# Altium schematic sheet design1.SchDoc
size 578 x 245 mm; Origin: Eagle
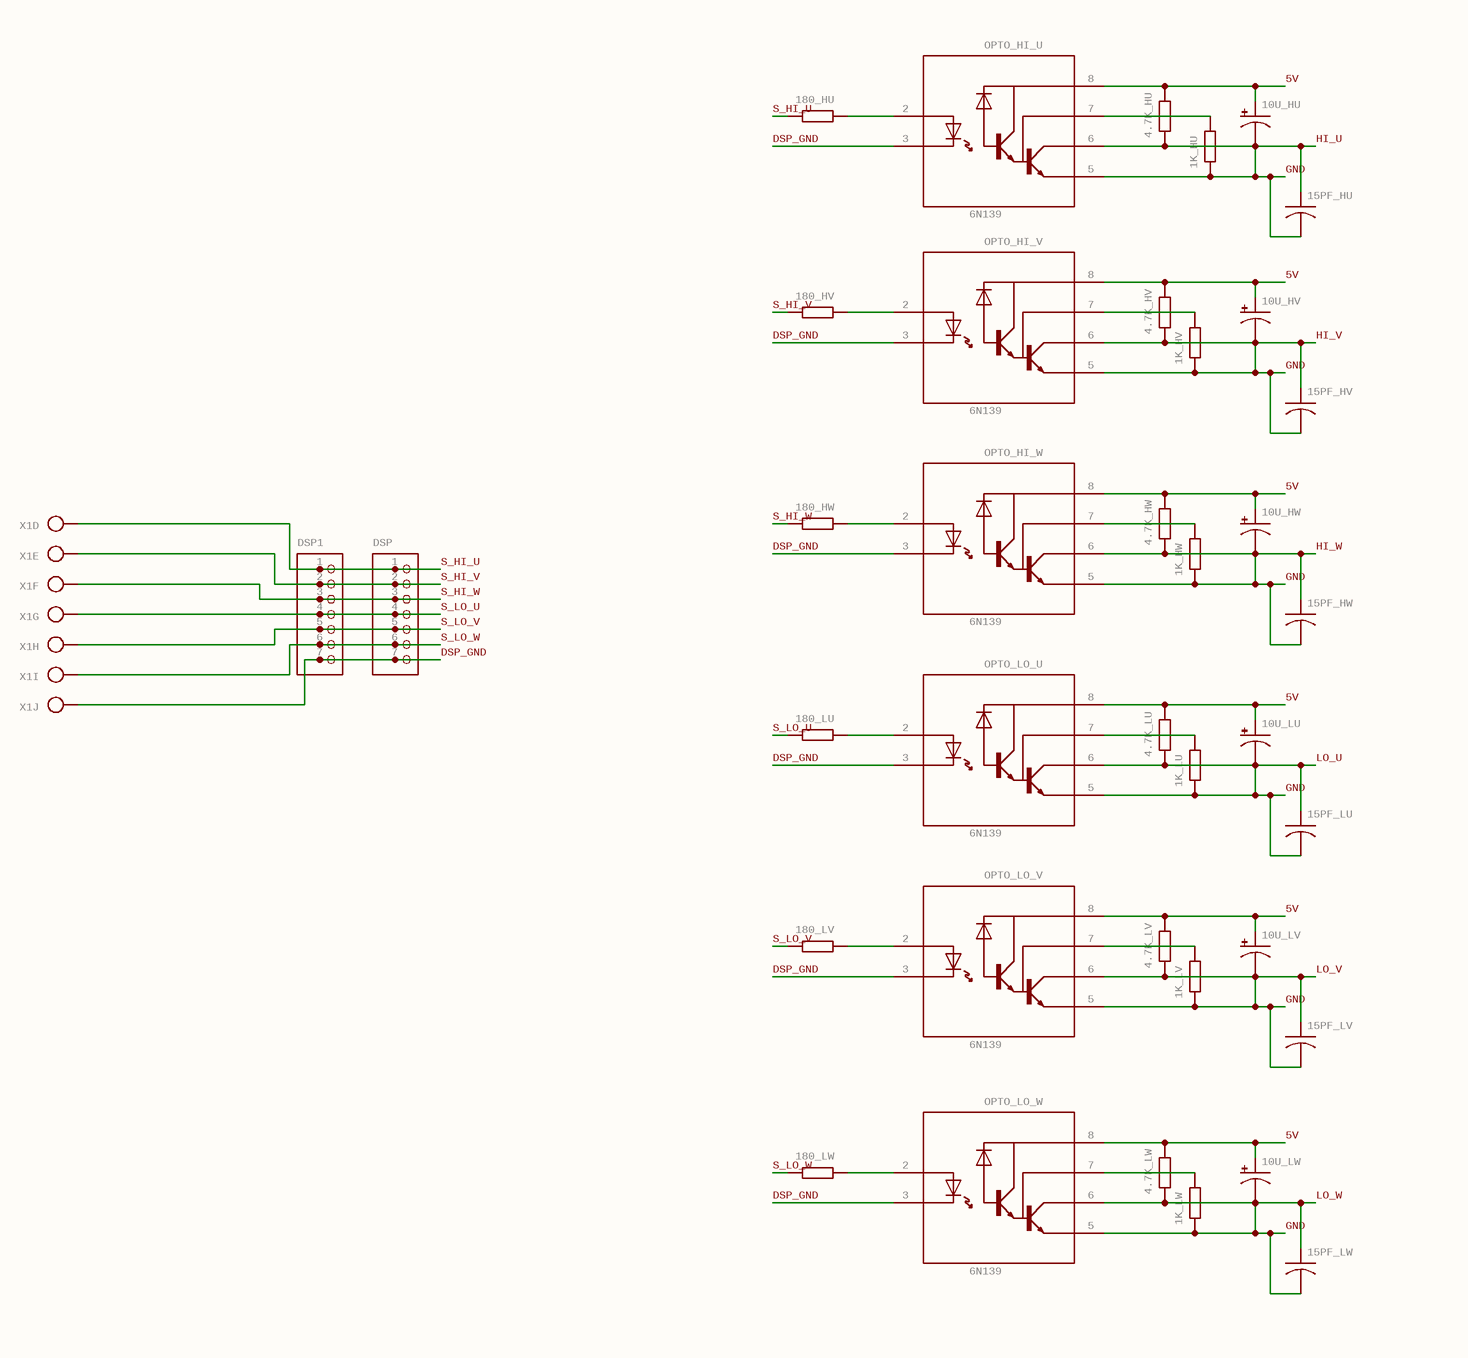
[diagram p0: design1.SchDoc, left]
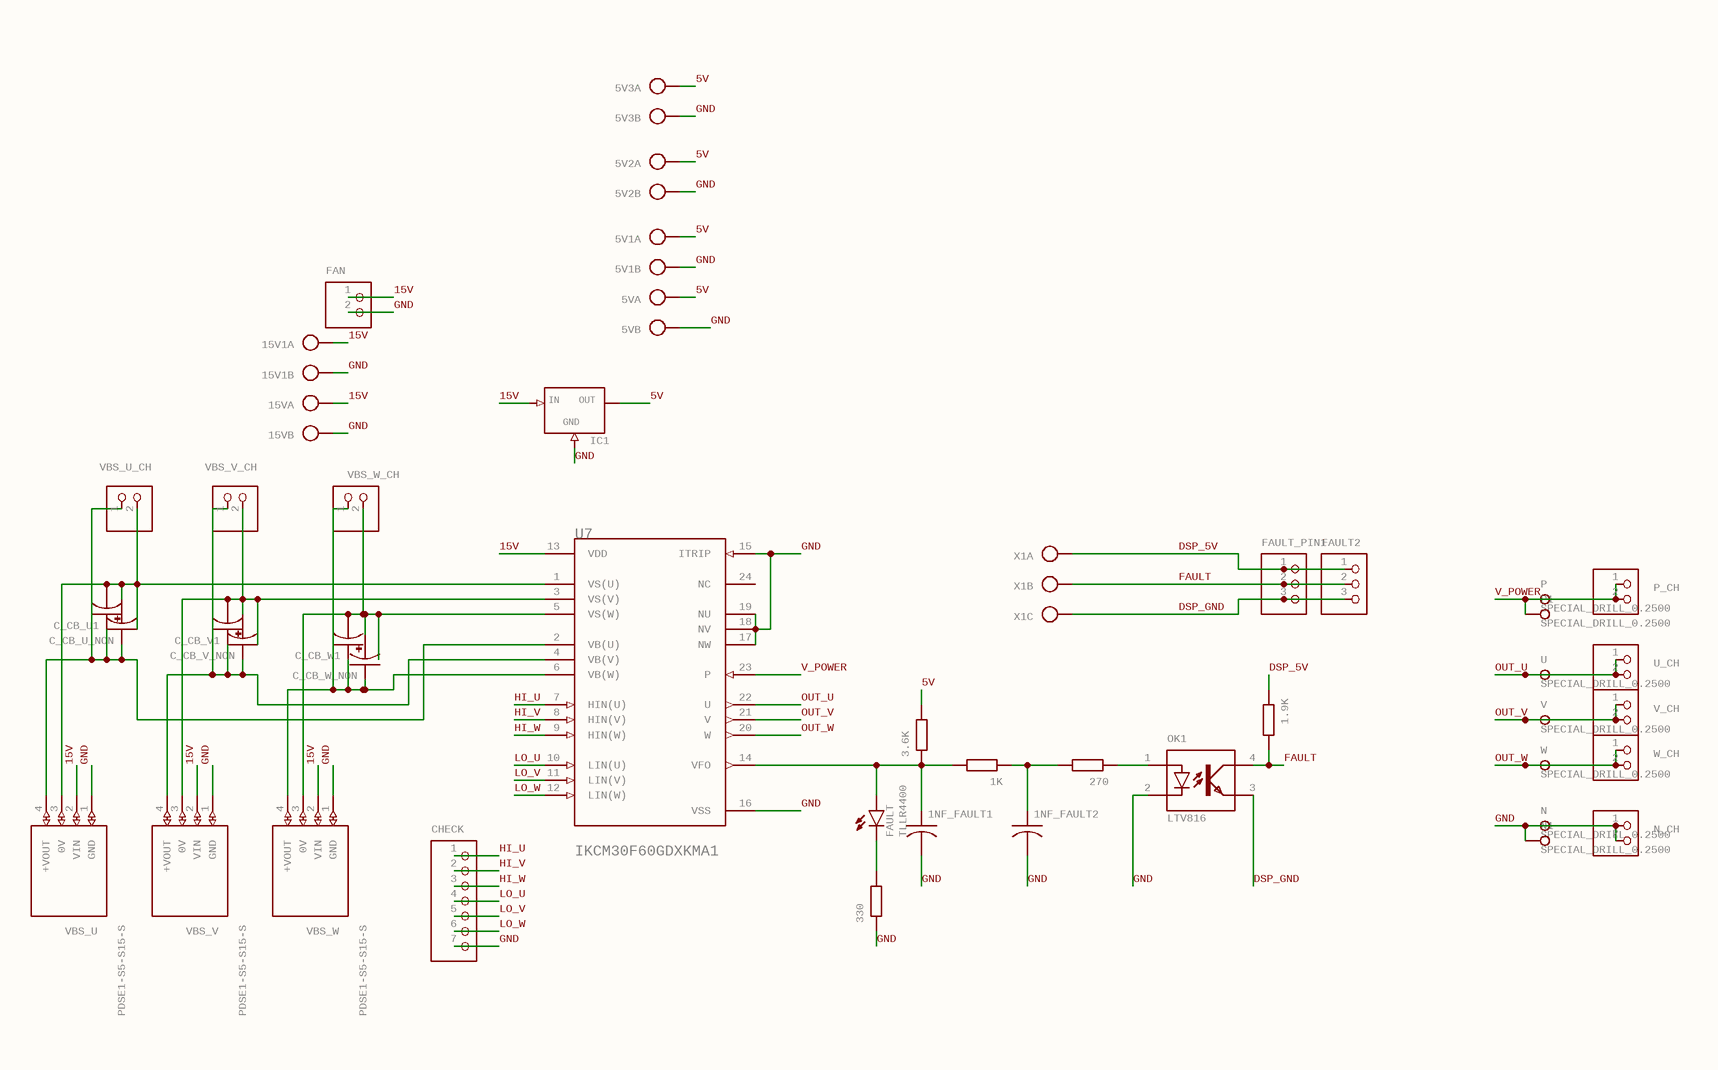
[diagram p1: design1.SchDoc, right]

## Parts
1.9K  R-EU_0207/12  [0207/12]  (value not drawn)
1K  R-EU_0207/12  [0207/12]  (value not drawn)
1K_HU  R-EU_0207/12  [0207/12]  (value not drawn)
1K_HV  R-EU_0207/12  [0207/12]  (value not drawn)
1K_HW  R-EU_0207/12  [0207/12]  (value not drawn)
1K_LU  R-EU_0207/12  [0207/12]  (value not drawn)
1K_LV  R-EU_0207/12  [0207/12]  (value not drawn)
1K_LW  R-EU_0207/12  [0207/12]  (value not drawn)
1NF_FAULT1  C-US025-025X050  [C025-025X050]  (value not drawn)
1NF_FAULT2  C-US025-025X050  [C025-025X050]  (value not drawn)
3.6K  R-EU_0207/12  [0207/12]  (value not drawn)
4.7K_HU  R-EU_0207/12  [0207/12]  (value not drawn)
4.7K_HV  R-EU_0207/12  [0207/12]  (value not drawn)
4.7K_HW  R-EU_0207/12  [0207/12]  (value not drawn)
4.7K_LU  R-EU_0207/12  [0207/12]  (value not drawn)
4.7K_LV  R-EU_0207/12  [0207/12]  (value not drawn)
4.7K_LW  R-EU_0207/12  [0207/12]  (value not drawn)
5V  AK500/2  [AK500/2]  (value not drawn)  (parts A,B of 2)
5V1  AK500/2  [AK500/2]  (value not drawn)  (parts A,B of 2)
5V2  AK500/2  [AK500/2]  (value not drawn)  (parts A,B of 2)
5V3  AK500/2  [AK500/2]  (value not drawn)  (parts A,B of 2)
10U_HU  CPOL-USE2-4  [E2-4]  (value not drawn)
10U_HV  CPOL-USE2-4  [E2-4]  (value not drawn)
10U_HW  CPOL-USE2-4  [E2-4]  (value not drawn)
10U_LU  CPOL-USE2-4  [E2-4]  (value not drawn)
10U_LV  CPOL-USE2-4  [E2-4]  (value not drawn)
10U_LW  CPOL-USE2-4  [E2-4]  (value not drawn)
15PF_HU  C-US025-025X050  [C025-025X050]  (value not drawn)
15PF_HV  C-US025-025X050  [C025-025X050]  (value not drawn)
15PF_HW  C-US025-025X050  [C025-025X050]  (value not drawn)
15PF_LU  C-US025-025X050  [C025-025X050]  (value not drawn)
15PF_LV  C-US025-025X050  [C025-025X050]  (value not drawn)
15PF_LW  C-US025-025X050  [C025-025X050]  (value not drawn)
15V  AK500/2  [AK500/2]  (value not drawn)  (parts A,B of 2)
15V1  AK500/2  [AK500/2]  (value not drawn)  (parts A,B of 2)
180_HU  R-EU_0207/12  [0207/12]  (value not drawn)
180_HV  R-EU_0207/12  [0207/12]  (value not drawn)
180_HW  R-EU_0207/12  [0207/12]  (value not drawn)
180_LU  R-EU_0207/12  [0207/12]  (value not drawn)
180_LV  R-EU_0207/12  [0207/12]  (value not drawn)
180_LW  R-EU_0207/12  [0207/12]  (value not drawn)
270  R-EU_0207/12  [0207/12]  (value not drawn)
330  R-EU_0207/12  [0207/12]  (value not drawn)
C_CB_U1  CPOL-USE2-4  [E2-4]  (value not drawn)
C_CB_U_NON  C-US025-025X050  [C025-025X050]  (value not drawn)
C_CB_V1  CPOL-USE2-4  [E2-4]  (value not drawn)
C_CB_V_NON  C-US025-025X050  [C025-025X050]  (value not drawn)
C_CB_W1  CPOL-USE2-4  [E2-4]  (value not drawn)
C_CB_W_NON  C-US025-025X050  [C025-025X050]  (value not drawn)
CHECK  PINHD-1X7  [1X07]  (value not drawn)
DSP  PINHD-1X7/90  [1X07/90]  (value not drawn)
DSP1  PINHD-1X7  [1X07]  (value not drawn)
FAN  PINHD-1X2  [1X02]  (value not drawn)
FAULT  TLLR4400  [LED3MM]
FAULT2  PINHD-1X3/90  [1X03/90]  (value not drawn)
FAULT_PIN1  PINHD-1X3  [1X03]  (value not drawn)
IC1  78XXS  [78XXS]  (value not drawn)
N  SPECIAL_DRILL_0.2500  [PAD_0.2500]
N1  SPECIAL_DRILL_0.2500  [PAD_0.2500]
N_CH  PINHD-1X2  [1X02]  (value not drawn)
OK1  LTV816  [DIL04]
OPTO_HI_U  6N139  [DIP762W50P254L977H451Q8]
OPTO_HI_V  6N139  [DIP762W50P254L977H451Q8]
OPTO_HI_W  6N139  [DIP762W50P254L977H451Q8]
OPTO_LO_U  6N139  [DIP762W50P254L977H451Q8]
OPTO_LO_V  6N139  [DIP762W50P254L977H451Q8]
OPTO_LO_W  6N139  [DIP762W50P254L977H451Q8]
P  SPECIAL_DRILL_0.2500  [PAD_0.2500]
P1  SPECIAL_DRILL_0.2500  [PAD_0.2500]
P_CH  PINHD-1X2  [1X02]  (value not drawn)
U  SPECIAL_DRILL_0.2500  [PAD_0.2500]
U7  INFINEON_IKCM30F60GDXKMA1INFINEON_IKCM30F60GDXKMA1_0_0  [INFINEON_IKCM30F60GDXKMA1_0]  (value not drawn)
U_CH  PINHD-1X2  [1X02]  (value not drawn)
V  SPECIAL_DRILL_0.2500  [PAD_0.2500]
V_CH  PINHD-1X2  [1X02]  (value not drawn)
VBS_U  PDSE1-S5-S15-S  [PDSE1S5S15S]
VBS_U_CH  PINHD-1X2  [1X02]  (value not drawn)
VBS_V  PDSE1-S5-S15-S  [PDSE1S5S15S]
VBS_V_CH  PINHD-1X2  [1X02]  (value not drawn)
VBS_W  PDSE1-S5-S15-S  [PDSE1S5S15S]
VBS_W_CH  PINHD-1X2  [1X02]  (value not drawn)
W  SPECIAL_DRILL_0.2500  [PAD_0.2500]
W_CH  PINHD-1X2  [1X02]  (value not drawn)
X1  AK500/10  [AK500/10]  (value not drawn)  (parts A,B,C,D,E,F,G,H,I,J of 10)

## Nets
5V: 3.6K.2 4.7K_HU.2 4.7K_HV.2 4.7K_HW.2 4.7K_LU.2 4.7K_LV.2 4.7K_LW.2 5V.1(KL) 5V1.1(KL) 5V2.1(KL) 5V3.1(KL) 10U_HU.+ 10U_HV.+ 10U_HW.+ 10U_LU.+ 10U_LV.+ 10U_LW.+ IC1.OUT OPTO_HI_U.8(VCC) OPTO_HI_V.8(VCC) OPTO_HI_W.8(VCC) OPTO_LO_U.8(VCC) OPTO_LO_V.8(VCC) OPTO_LO_W.8(VCC)
15V: 15V.1(KL) 15V1.1(KL) FAN.1 IC1.IN U7.13(VDD) VBS_U.2(VIN) VBS_V.2(VIN) VBS_W.2(VIN)
DSP_5V: 1.9K.1 FAULT2.1 FAULT_PIN1.1 X1.1(KL)
DSP_GND: DSP.7 DSP1.7 FAULT2.3 FAULT_PIN1.3 OK1.3(EMIT) OPTO_HI_U.3(C) OPTO_HI_V.3(C) OPTO_HI_W.3(C) OPTO_LO_U.3(C) OPTO_LO_V.3(C) OPTO_LO_W.3(C) X1.3(KL) X1.10(KL)
FAULT: 1.9K.2 FAULT2.2 FAULT_PIN1.2 OK1.4(COL) X1.2(KL)
GND: 1K_HU.1 1K_HV.1 1K_HW.1 1K_LU.1 1K_LV.1 1K_LW.1 1NF_FAULT1.2 1NF_FAULT2.2 4.7K_HU.1 4.7K_HV.1 4.7K_HW.1 4.7K_LU.1 4.7K_LV.1 4.7K_LW.1 5V.2(KL) 5V1.2(KL) 5V2.2(KL) 5V3.2(KL) 10U_HU.- 10U_HV.- 10U_HW.- 10U_LU.- 10U_LV.- 10U_LW.- 15PF_HU.1 15PF_HU.2 15PF_HV.1 15PF_HV.2 15PF_HW.1 15PF_HW.2 15PF_LU.1 15PF_LU.2 15PF_LV.1 15PF_LV.2 15PF_LW.1 15PF_LW.2 15V.2(KL) 15V1.2(KL) 330.1 CHECK.1 CHECK.2 CHECK.3 CHECK.4 CHECK.5 CHECK.6 CHECK.7 FAN.2 IC1.GND N.1 N1.1 N_CH.1 N_CH.2 OK1.2(C) OPTO_HI_U.5(GND) OPTO_HI_U.6(VO) OPTO_HI_V.5(GND) OPTO_HI_V.6(VO) OPTO_HI_W.5(GND) OPTO_HI_W.6(VO) OPTO_LO_U.5(GND) OPTO_LO_U.6(VO) OPTO_LO_V.5(GND) OPTO_LO_V.6(VO) OPTO_LO_W.5(GND) OPTO_LO_W.6(VO) U7.7(HIN(U)) U7.8(HIN(V)) U7.9(HIN(W)) U7.10(LIN(U)) U7.11(LIN(V)) U7.12(LIN(W)) U7.15(ITRIP) U7.16(VSS) U7.17(NW) U7.18(NV) U7.19(NU) VBS_U.1(GND) VBS_V.1(GND) VBS_W.1(GND)  [also labelled HI_U, HI_V, HI_W, LO_U, LO_V, LO_W]
OUT_U: U.1 U7.22(U) U_CH.1 U_CH.2
OUT_V: U7.21(V) V.1 V_CH.1 V_CH.2
OUT_W: U7.20(W) W.1 W_CH.1 W_CH.2
S_HI_U: 180_HU.1 DSP.1 DSP1.1 X1.4(KL)
S_HI_V: 180_HV.1 DSP.2 DSP1.2 X1.5(KL)
S_HI_W: 180_HW.1 DSP.3 DSP1.3 X1.6(KL)
S_LO_U: 180_LU.1 DSP.4 DSP1.4 X1.7(KL)
S_LO_V: 180_LV.1 DSP.5 DSP1.5 X1.8(KL)
S_LO_W: 180_LW.1 DSP.6 DSP1.6 X1.9(KL)
V_POWER: P.1 P1.1 P_CH.1 P_CH.2 U7.23(P)
Net1K_1: 1K.1 1NF_FAULT2.1 270.2
Net1K_2: 1K.2 1NF_FAULT1.1 3.6K.1 FAULT.A U7.14(VFO)
Net1K_HU_2: 1K_HU.2 OPTO_HI_U.7(VB)
Net1K_HV_2: 1K_HV.2 OPTO_HI_V.7(VB)
Net1K_HW_2: 1K_HW.2 OPTO_HI_W.7(VB)
Net1K_LU_2: 1K_LU.2 OPTO_LO_U.7(VB)
Net1K_LV_2: 1K_LV.2 OPTO_LO_V.7(VB)
Net1K_LW_2: 1K_LW.2 OPTO_LO_W.7(VB)
Net180_HU_2: 180_HU.2 OPTO_HI_U.2(A)
Net180_HV_2: 180_HV.2 OPTO_HI_V.2(A)
Net180_HW_2: 180_HW.2 OPTO_HI_W.2(A)
Net180_LU_2: 180_LU.2 OPTO_LO_U.2(A)
Net180_LV_2: 180_LV.2 OPTO_LO_V.2(A)
Net180_LW_2: 180_LW.2 OPTO_LO_W.2(A)
Net270_1: 270.1 OK1.1(A)
Net330_2: 330.2 FAULT.K(C)
NetC_CB_U1_+: C_CB_U1.+ C_CB_U_NON.1 U7.2(VB(U)) VBS_U.4(+VOUT) VBS_U_CH.1
NetC_CB_U1_-: C_CB_U1.- C_CB_U_NON.2 U7.1(VS(U)) VBS_U.3(0V) VBS_U_CH.2
NetC_CB_V1_+: C_CB_V1.+ C_CB_V_NON.1 U7.4(VB(V)) VBS_V.4(+VOUT) VBS_V_CH.1
NetC_CB_V1_-: C_CB_V1.- C_CB_V_NON.2 U7.3(VS(V)) VBS_V.3(0V) VBS_V_CH.2
NetC_CB_W1_+: C_CB_W1.+ C_CB_W_NON.1 U7.6(VB(W)) VBS_W.4(+VOUT) VBS_W_CH.1
NetC_CB_W1_-: C_CB_W1.- C_CB_W_NON.2 U7.5(VS(W)) VBS_W.3(0V) VBS_W_CH.2

Not connected (* = marked no-connect by the designer): U7 24(NC)

## Library data of the parts
1.9K 1K 1K_HU 1K_HV 1K_HW 1K_LU 1K_LV 1K_LW 3.6K 4.7K_HU 4.7K_HV 4.7K_HW 4.7K_LU 4.7K_LV 4.7K_LW 180_HU 180_HV 180_HW 180_LU 180_LV 180_LW 270 330 = R-EU_0207/12: RESISTOR, European symbol; GateName_1: G$1; SymbolName_1: R-EU; DeviceSetName: R-EU_; POPULARITY: 9; DeviceName: 0207/12; LibraryName: rcl; SPICEPREFIX: R
1NF_FAULT1 1NF_FAULT2 15PF_HU 15PF_HV 15PF_HW 15PF_LU 15PF_LV 15PF_LW C_CB_U_NON C_CB_V_NON C_CB_W_NON = C-US025-025X050: CAPACITOR, American symbol; GateName_1: G$1; SymbolName_1: C-US; POPULARITY: 0; DeviceName: 025-025X050; LibraryName: rcl; DeviceSetName: C-US; SPICEPREFIX: C
5V 5V1-5V3 15V 15V1 = AK500/2: CONNECTOR; GateName_1: -1; SymbolName_1: KL; GateName_2: -2; SymbolName_2: KLV; POPULARITY: 14; LibraryName: con-ptr500; DeviceSetName: AK500/2; MF: MF; MPN: MPN; OC_FARNELL: unknown; OC_NEWARK: unknown
10U_HU 10U_HV 10U_HW 10U_LU 10U_LV 10U_LW C_CB_U1 C_CB_V1 C_CB_W1 = CPOL-USE2-4: POLARIZED CAPACITOR, American symbol; GateName_1: G$1; POPULARITY: 0; SymbolName_1: CPOL-US; DeviceName: E2-4; LibraryName: rcl; DeviceSetName: CPOL-US; SPICEPREFIX: C
CHECK DSP1 = PINHD-1X7: PIN HEADER; GateName_1: A; SymbolName_1: PINHD7; POPULARITY: 0; LibraryName: pinhead; DeviceSetName: PINHD-1X7
DSP = PINHD-1X7/90: PIN HEADER; GateName_1: A; SymbolName_1: PINHD7; DeviceName: /90; POPULARITY: 1; LibraryName: pinhead; DeviceSetName: PINHD-1X7
FAN N_CH P_CH U_CH V_CH VBS_U_CH VBS_V_CH VBS_W_CH W_CH = PINHD-1X2: PIN HEADER; GateName_1: G$1; SymbolName_1: PINHD2; POPULARITY: 98; LibraryName: pinhead; DeviceSetName: PINHD-1X2
FAULT = TLLR4400: Low Current (2mA) LED 3 mm Tinted Diffused Package color RED   Source:  Data sheet; GateName_1: G$1; MF: VISHAY SEMICONDUCTOR; POPULARITY: 2; SymbolName_1: LED; LibraryName: led; DeviceSetName: TLLR4400; OC_FARNELL: 1612437
FAULT2 = PINHD-1X3/90: PIN HEADER; GateName_1: A; SymbolName_1: PINHD3; DeviceName: /90; POPULARITY: 17; LibraryName: pinhead; DeviceSetName: PINHD-1X3
FAULT_PIN1 = PINHD-1X3: PIN HEADER; GateName_1: A; SymbolName_1: PINHD3; POPULARITY: 92; LibraryName: pinhead; DeviceSetName: PINHD-1X3
IC1 = 78XXS: VOLTAGE REGULATOR; GateName_1: 1; SymbolName_1: 78XX; POPULARITY: 18; LibraryName: v-reg; DeviceSetName: 78XXS; GND: GND; IN: IN; OUT: OUT
N N1 P P1 U V W = SPECIAL_DRILL_0.2500: Special drills; GateName_1: G$1; DeviceName: 0.2500; SymbolName_1: SPECIAL_DRILL; LibraryName: special-drill; DeviceSetName: SPECIAL_DRILL_
OK1 = LTV816: OPTO COUPLER   Source: LITEON, LTV816.pdf; GateName_1: G$1; SymbolName_1: OK; POPULARITY: 3; LibraryName: optocoupler; DeviceSetName: LTV816; MF: MF; MPN: MPN; OC_FARNELL: unknown; OC_NEWARK: unknown
OPTO_HI_U OPTO_HI_V OPTO_HI_W OPTO_LO_U OPTO_LO_V OPTO_LO_W = 6N139: High Speed Optocoupler, 100 kBd, Low Input Current, Photodiode Darlington Output Check availability; GateName_1: G$1; MF: Vishay Semiconductor; SymbolName_1: 6N139; LibraryName: 6N139; DeviceSetName: 6N139; AVAILABILITY: In Stock; MP: 6N139; PACKAGE: DIP-8 Rochester Electronics; PRICE: None; PURCHASE-URL: https://pricing.snapeda.com/search?q=6N139&ref=eda
U7 = INFINEON_IKCM30F60GDXKMA1INFINEON_IKCM30F60GDXKMA1_0_0: Trans IGBT Module N-CH 24-Pin MDIP; GateName_1: G$0; CENTROID_NOT_SPECIFIED: No; DEVICE_CLASS_L1: Integrated Circuits (ICs); DEVICE_CLASS_L2: Power Management ICs; DEVICE_CLASS_L3: Motor Drivers; LEAD_FREE: yes; MAX_JUNCTION_TEMP: +150°C; MAX_POWER_DISSIPATION: 79.1W; MAX_SUPPLY_VOLTAGE: 18.5V; MFG_PACKAGE_IDENT: PG-MDIP-24; MFG_PACKAGE_IDENT_REV: 0; MIN_SUPPLY_VOLTAGE: 13.5V; NUMBER_OF_OUTPUTS: 1; OUTPUT_CURRENT: 30A; PREFIX: U; STANDOFF_HEIGHT: 1.7mm; SWITCHING_FREQUENCY: 20kHz; TEMPERATURE_RANGE_HIGH: +125°C; TEMPERATURE_RANGE_LOW: -40°C; VERIFICATION_VERSION: 0.0.0.1; SymbolName_1: INFINEON_IKCM30F60GDXKMA1_0_0; DeviceName: INFINEON_IKCM30F60GDXKMA1_0_0; LibraryName: Infineon - IKCM30F60GDXKMA1; DeviceSetName: INFINEON_IKCM30F60GDXKMA1; IKCM30F60GDXKMA1: IKCM30F60GDXKMA1; DATASHEET: https://www.infineon.com/dgdl/Infineon-IKCM30F60GD-DS-v02_04-EN.pdf?fileId=5546d4624fb7fef2014fcb9626d07936; DIGIKEY_DESCRIPTION: IC IFPS MODULES 24MDIP; DIGIKEY_PART_NUMBER: IKCM30F60GDXKMA1-ND; HEIGHT: 5.6mm; MF: Infineon; MFG_PACKAGE_IDENT_DATE: 0; MOUSER_DESCRIPTION: Motor / Motion / Ignition Controllers & Drivers IFPS MODULES; MOUSER_PART_NUMBER: 726-IKCM30F60GDXKMA1; MPN: IKCM30F60GDXKMA1; PACKAGE: 24-PowerDIP Module; ROHS: yes
VBS_U VBS_V VBS_W = PDSE1-S5-S15-S: Isolated DC/DC Converters dc-dc isolated, 1 W, 4.5 5.5 Vdc input, 15 Vdc, 0.067 A, single unregulated output, SIP   Source:  Datasheet; MANUFACTURER_NAME: CUI Inc.; GateName_1: G$1; SymbolName_1: PDSE1-S5-S15-S; LibraryName: PDSE1-S5-S15-S; DeviceSetName: PDSE1-S5-S15-S; HEIGHT: 10.41mm; MANUFACTURER_PART_NUMBER: PDSE1-S5-S15-S; UTMEL_PART_NUMBER: UTMEL_PART_NUMBER; UTMEL_PRICE-STOCK: UTMEL_PRICE-STOCK
X1 = AK500/10: CONNECTOR; GateName_1: -1; SymbolName_1: KL; GateName_2: -2; GateName_3: -3; GateName_4: -4; GateName_5: -5; GateName_6: -6; GateName_7: -7; GateName_8: -8; GateName_9: -9; GateName_10: -10; SymbolName_10: KLV; POPULARITY: 2; SymbolName_2: KL; SymbolName_3: KL; SymbolName_4: KL; SymbolName_5: KL; SymbolName_6: KL; SymbolName_7: KL; SymbolName_8: KL; SymbolName_9: KL; LibraryName: con-ptr500; DeviceSetName: AK500/10; MF: MF; MPN: MPN; OC_FARNELL: unknown; OC_NEWARK: unknown